# Altium schematic sheet Low_power_detector.SchDoc
size Letter
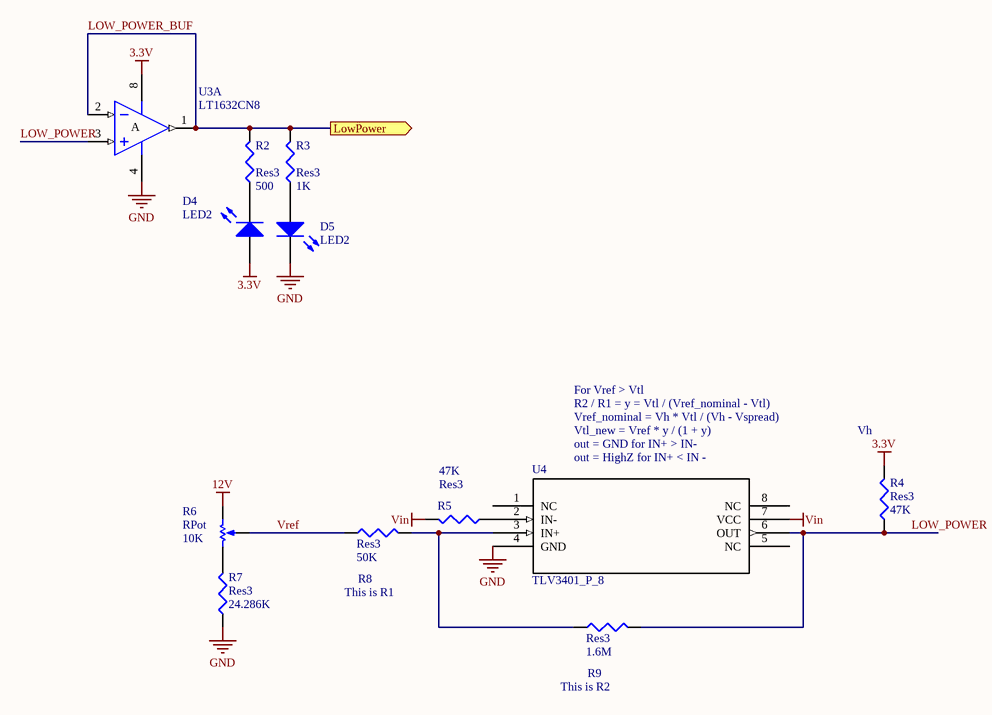
[diagram p0: Low_power_detector.SchDoc]

## Parts
D4  LED2  [3.2X1.6X1.1]
D5  LED2  [3.2X1.6X1.1]
R2  Res3  value 500  [AXIAL-0.3]
R3  Res3  value 1K  [AXIAL-0.3]
R4  Res3  value 47K  [AXIAL-0.3]
R5  Res3  value 47K  [AXIAL-0.3]
R6  RPot  value 10K  [RPot]
R7  Res3  value 24.286K  [AXIAL-0.3]
R8  Res3  value 50K  [AXIAL-0.3]
R9  Res3  value 1.6M  [AXIAL-0.3]
U3  LT1632CN8  [P8]  (part A of 2)
U4  TLV3401_P_8  [P8]

## Ports
LowPower (out)

## Nets
3.3V: D4.1(A) R4.2 U3.8(V+)
12V: R6.1(TOP)
GND: D5.2(K) R7.1 U3.4(V-) U4.4(GND)
Vin: R5.2 U4.7(VCC)
LOW_POWER: R4.1 R9.2 U3.3(IN+) U4.6(OUT)
LOW_POWER_BUF: R2.2 R3.2 U3.1(OUT) U3.2(IN-) ; port LowPower
Vref: R6.3(TAP) R8.1
NetD4_2: D4.2(K) R2.1
NetD5_1: D5.1(A) R3.1
NetR5_1: R5.1 U4.2(IN-)
NetR6_2: R6.2(BOT) R7.2
NetR8_2: R8.2 R9.1 U4.3(IN+)

Not connected (* = marked no-connect by the designer): U4 1(NC) 5(NC) 8(NC)

## Notes on the sheet
- R2 / R1 = y = Vtl / (Vref_nominal - Vtl)
- For Vref > Vtl
- out = GND for IN+ > IN-
- (near U4) out = HighZ for IN+ < IN -
- Vtl_new = Vref * y / (1 + y)
- Vref_nominal = Vh * Vtl / (Vh - Vspread)
- (near R4) Vh
- This is R1
- This is R2
- (in symbol LT1632CN8, part A) A

## Library data of the parts
D4 D5 = LED2: Typical RED, GREEN, YELLOW, AMBER GaAs LED; Published: 8-Jun-2000; LatestRevisionDate: 17-Jul-2002; LatestRevisionNote: Re-released for DXP Platform.; PackageVersion: Feb-2002; PackageReference: 3.2X1.6X1.1; Publisher: Altium Limited; PackageDescription: SM LED; 2 Flat Leads
R2-R5 R7-R9 = Res3: Resistor; Published: 8-Jun-2000; LatestRevisionDate: 29-May-2009; LatestRevisionNote: IPC-7351 Footprint Added.; PackageReference: J1-0603; Publisher: Altium Limited; PackageDescription: Chip Resistor
R6 = RPot: Potentiometer; Sim Note: Enter the Resistance value and the set point into parameter fields.; Set Position: 0.5; Published: 8-Jun-2000; LatestRevisionDate: 17-Jul-2002; LatestRevisionNote: Re-released for DXP Platform.; PackageReference: VR5; Publisher: Altium Limited; PackageDescription: Variable Resistor, Thru-Hole; 3 Leads
U3 = LT1632CN8: 45MHz, 45V/µs, Dual Rail-to-Rail Input and Output Precision Operational Amplifier; Note: 1455; Published: 8-Jun-2000; LatestRevisionDate: 29-May-2009; LatestRevisionNote: Component Body Added.; DatasheetVersion: 1996; PackageVersion: N8 1002; PackageReference: N8; Publisher: Altium Limited; PackageDescription: DIP, Plastic, 8-Pin, Row Spacing 7.62 mm, Pitch 2.54 mm; ComponentLink1Description: Manufacturer Link; ComponentLink1URL: http://www.linear.com/; ComponentLink2Description: Datasheet; ComponentLink2URL: http://www.linear.com/pc/downloadDocument.do?navId=H0,C1,C1154,C1009,C1022,P1642,D3055
U4 = TLV3401_P_8: Imported; Vendor: Texas Instruments; PACKAGE_DESIGNATOR: P; PIN_COUNT: 8; FAMILY_NAME: COMPARATOR; INDUSTRY_STD_PKG_TYPE: PDIP; Manufacturer_Part_Number: tlv3401_p_8; GENERIC_PART_NUMBER: TLV3401; Datasheet URL: http://www.ti.com/lit/gpn/TLV3401; Manufacturer: Texas Instruments; RefDes: RefDes; Type: DEV; Value: Value